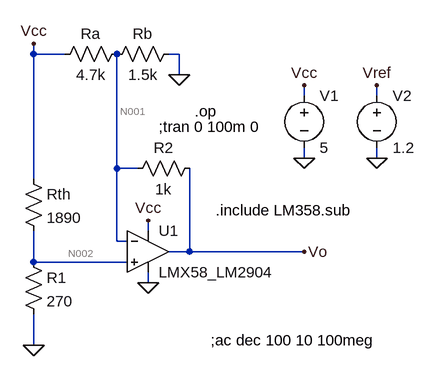
[diagram p0: schematic Termistor.asc]
Termistor.asc, the LTspice schematic file:
Version 4
SHEET 1 880 680
WIRE 64 -160 64 -176
WIRE 112 -160 64 -160
WIRE 288 -160 272 -160
WIRE 288 -128 288 -160
WIRE 480 -96 480 -112
WIRE 592 -96 592 -112
WIRE 480 0 480 -16
WIRE 592 0 592 -16
WIRE 192 16 192 -160
WIRE 224 16 192 16
WIRE 64 32 64 -160
WIRE 240 112 240 96
WIRE 192 128 192 16
WIRE 208 128 192 128
WIRE 304 144 304 16
WIRE 304 144 272 144
WIRE 480 144 304 144
WIRE 64 160 64 112
WIRE 208 160 64 160
WIRE 240 192 240 176
WIRE 64 288 64 240
FLAG 64 288 0
FLAG 480 0 0
FLAG 592 0 0
FLAG 592 -112 Vref
FLAG 64 -176 Vcc
FLAG 240 96 Vcc
FLAG 240 192 0
FLAG 480 144 Vo
FLAG 480 -112 Vcc
FLAG 288 -128 0
DATAFLAG 64 -48 ""
DATAFLAG 64 144 ""
DATAFLAG 192 -160 ""
DATAFLAG 304 48 ""
SYMBOL res 48 16 R0
SYMATTR InstName Rth
SYMATTR Value 1890
SYMBOL res 48 144 R0
SYMATTR InstName R1
SYMATTR Value 270
SYMBOL Opamps\\opamp2 240 80 R0
SYMATTR InstName U1
SYMATTR Value LMX58_LM2904
SYMBOL res 320 0 R90
WINDOW 0 0 56 VBottom 2
WINDOW 3 32 56 VTop 2
SYMATTR InstName R2
SYMATTR Value 1k
SYMBOL voltage 480 -112 R0
WINDOW 123 0 0 Left 0
WINDOW 39 0 0 Left 0
SYMATTR InstName V1
SYMATTR Value 5
SYMBOL voltage 592 -112 R0
WINDOW 123 0 0 Left 0
WINDOW 39 0 0 Left 0
SYMATTR InstName V2
SYMATTR Value 1.2
SYMBOL res 288 -176 R90
WINDOW 0 0 56 VBottom 2
WINDOW 3 32 56 VTop 2
SYMATTR InstName Rb
SYMATTR Value 1.5k
SYMBOL res 208 -176 R90
WINDOW 0 0 56 VBottom 2
WINDOW 3 32 56 VTop 2
SYMATTR InstName Ra
SYMATTR Value 4.7k
TEXT 312 -72 Left 2 !.op
TEXT 344 80 Left 2 !.include LM358.sub
TEXT 336 280 Left 2 !;ac dec 100 10 100meg
TEXT 256 -48 Left 2 !;tran 0 100m 0

The netlist it stands for:
* Termistor.asc
Rth Vcc N002 1890
R1 N002 0 270
XU1 N002 N001 Vcc 0 Vo LMX58_LM2904  ; pins In+ In- V+ V- OUT
R2 Vo N001 1k
V1 Vcc 0 5
V2 Vref 0 1.2
Rb 0 N001 1.5k
Ra N001 Vcc 4.7k
.op
.include LM358.sub
;ac dec 100 10 100meg
;tran 0 100m 0
.backanno
.end

* Results of the author's LTspice run, read from the files saved beside the schematic
* Operating Point:
*   V(vcc) = 5 V
*   V(n002) = 625 mV
*   V(vo) = 632.6 mV
*   V(n001) = 902.6 mV
*   V(vref) = 1.2 V
*   I(Ra) = -871.8 µA
*   I(Rb) = -601.8 µA
*   I(R2) = -270 µA
*   I(R1) = 2.315 mA
*   I(Rth) = 2.315 mA
*   I(V2) = 0 A
*   I(V1) = -3.537 mA
*   Ix(u1:IN+) = -20 nA
*   Ix(u1:IN-) = -18 nA
*   Ix(u1:VCC) = 350 µA
*   Ix(u1:VEE) = -620 µA
*   Ix(u1:OUT) = 270 µA
* From the log:
*   Semiconductor Device Operating Points:
*                           --- Diodes ---
*   Name:  d:u1:e_n:2  d:u1:e_n:1  d:u1:i_np:2  d:u1:i_np:1  d:u1:i_nn:2
*   Model: u1:e_n:dvn  u1:e_n:dvn  u1:i_np:dvnf u1:i_np:dvnf u1:i_nn:dvnf
*   Id:      1.00e-02    1.00e-02    1.00e-02     1.00e-02     1.00e-02
*   Vd:      8.34e-01    8.34e-01    8.34e-01     8.34e-01     8.34e-01
*   Req:     2.59e+00    2.59e+00    2.59e+00     2.59e+00     2.59e+00
*   CAP:     0.00e+00    0.00e+00    0.00e+00     0.00e+00     0.00e+00
*   Name:  d:u1:i_nn:1
*   Model: u1:i_nn:dvnf
*   Id:      1.00e-02
*   Vd:      8.34e-01
*   Req:     2.59e+00
*   CAP:     0.00e+00